# EAGLE design ICDI_Bridge (EAGLE 9.2.2)
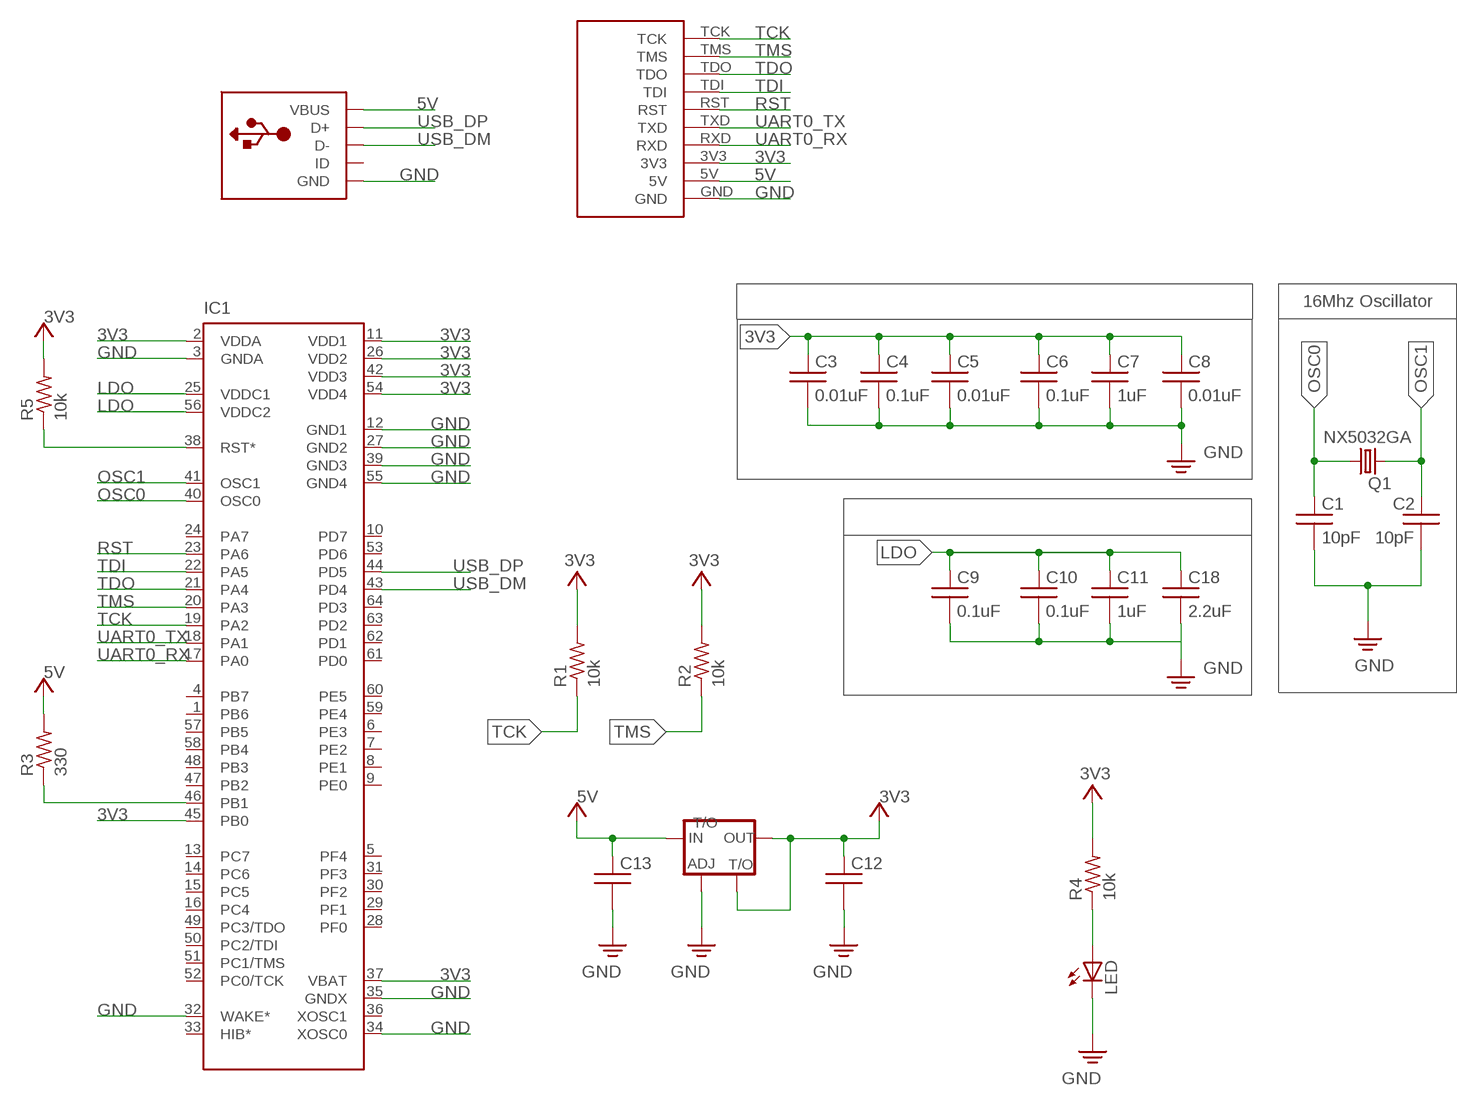
[diagram p0: schematic, sheet 1]

## Parts
C1  10pF  CAPACITORC0603K  [C0603K]
C2  10pF  CAPACITORC0603K  [C0603K]
C3  0.01uF  CAPACITORC0603K  [C0603K]
C4  0.1uF  CAPACITORC0603K  [C0603K]
C5  0.01uF  CAPACITORC0603K  [C0603K]
C6  0.1uF  CAPACITORC0603K  [C0603K]
C7  1uF  CAPACITORC0603K  [C0603K]
C8  0.01uF  CAPACITORC0603K  [C0603K]
C9  0.1uF  CAPACITORC0603K  [C0603K]
C10  0.1uF  CAPACITORC0603K  [C0603K]
C11  1uF  CAPACITORC0603K  [C0603K]
C12  CAPACITORC0805K  [C0805K]
C13  CAPACITORC0603K  [C0603K]
C18  2.2uF  CAPACITORC0603K  [C0603K]
IC1  TM4C123GH6PM  [SQFP-S-10X10-64]
LED  LEDCHIPLED_0603  [CHIPLED_0603]
Q1  NX5032GA  [NX5032GA]
R1  10k  RESISTORR0603  [R0603]
R2  10k  RESISTORR0603  [R0603]
R3  330  RESISTORR0603  [R0603]
R4  10k  RESISTORR0603  [R0603]
R5  10k  RESISTORR0603  [R0603]
U$1  USB_MICRO_PTH  [USB_MICRO_PTH]
U$2  JTAG_SERIAL  [JTAG_SERIAL_PTH]
U$4  _VOLTAGE_REGULATOR_AMS1117  [_PACKAGE_SOT223]

## Nets
3V3: C3.1 C4.1 C5.1 C6.1 C7.1 C8.1 C12.1 IC1.2(VDDA) IC1.11(VDD1) IC1.26(VDD2) IC1.37(VBAT) IC1.42(VDD3) IC1.45(PB0) IC1.54(VDD4) R1.2 R2.2 R4.2 R5.2 U$2.3V3 U$4.2(OUT) U$4.4(T/O) ; supply symbol labelled +3V3
5V: C13.1 R3.2 U$1.1(VBUS) U$2.5V U$4.3(IN) ; supply symbol labelled +5V
GND: C1.2 C2.2 C3.2 C4.2 C5.2 C6.2 C7.2 C8.2 C9.2 C10.2 C11.2 C12.2 C13.2 C18.2 IC1.3(GNDA) IC1.12(GND1) IC1.27(GND2) IC1.32(WAKE*) IC1.34(XOSC0) IC1.35(GNDX) IC1.39(GND3) IC1.55(GND4) LED.C U$1.5(GND) U$2.GND U$4.1(ADJ)
LDO: C9.1 C10.1 C11.1 C18.1 IC1.25(VDDC1) IC1.56(VDDC2)
N$1: LED.A R4.1
N$2: IC1.46(PB1) R3.1
N$4: IC1.38(RST*) R5.1
OSC0: C1.1 IC1.40(OSC0) Q1.1
OSC1: C2.1 IC1.41(OSC1) Q1.2
RST: IC1.23(PA6) U$2.RST
TCK: IC1.19(PA2) R1.1 U$2.TCK
TDI: IC1.22(PA5) U$2.TDI
TDO: IC1.21(PA4) U$2.TDO
TMS: IC1.20(PA3) R2.1 U$2.TMS
UART0_RX: IC1.17(PA0) U$2.RXD
UART0_TX: IC1.18(PA1) U$2.TXD
USB_DM: IC1.43(PD4) U$1.2(D-)
USB_DP: IC1.44(PD5) U$1.3(D+)
Unconnected: IC1.1(PB6) IC1.4(PB7) IC1.5(PF4) IC1.6(PE3) IC1.7(PE2) IC1.8(PE1) IC1.9(PE0) IC1.10(PD7) IC1.13(PC7) IC1.14(PC6) IC1.15(PC5) IC1.16(PC4) IC1.24(PA7) IC1.28(PF0) IC1.29(PF1) IC1.30(PF2) IC1.31(PF3) IC1.33(HIB*) IC1.36(XOSC1) IC1.47(PB2) IC1.48(PB3) IC1.49(PC3/TDO) IC1.50(PC2/TDI) IC1.51(PC1/TMS) IC1.52(PC0/TCK) IC1.53(PD6) IC1.57(PB5) IC1.58(PB4) IC1.59(PE4) IC1.60(PE5) IC1.61(PD0) IC1.62(PD1) IC1.63(PD2) IC1.64(PD3) U$1.4(ID)

## Notes on the sheet
- 16Mhz Oscillator

## Library data of the parts
C1-C13 C18 = UT_ECE:CAPACITOR: CAPACITOR, American symbol
IC1 = UT_ECE:TM4C123: Tiva™ TM4C123GH6PM Microcontroller Texas Instrument's Tiva™ C Series microcontrollers provide designers a high-performance ARM® Cortex™-M-based architecture with a broad set of integration capabilities and a strong ecosystem of software and development tools. Targeting performance and flexibility, the Tiva™ C Series architecture offers a 80 MHz Cortex-M with FPU, a variety of integrated memories and multiple programmable GPIO. Tiva™ C Series devices offer consumers compelling cost-effective solutions by integrating application-specific peripherals and providing a comprehensive library of software tools which minimize board costs and design-cycle time. Offering quicker time-to-market and cost savings, the Tiva™ C Series microcontrollers are the leading choice in high-performance 32-bit applications.
LED = adafruit:LED: LED OSRAM: - CHIPLED LG R971, LG N971, LY N971, LG Q971, LY Q971, LO R971, LY R971 LH N974, LH R974 LS Q976, LO Q976, LY Q976 LO Q996 - Hyper CHIPLED LW Q18S LB Q993, LB Q99A, LB R99A - SideLED LS A670, LO A670, LY A670, LG A670, LP A670 LB A673, LV A673, LT A673, LW A673 LH A674 LY A675 LS A676, LA A676, LO A676, LY A676, LW A676 LS A679, LY A679, LG A679 - Hyper Micro SIDELED® LS Y876, LA Y876, LO Y876, LY Y876 LT Y87S - SmartLED LW L88C, LW L88S LB L89C, LB L89S, LG L890 LS L89K, LO L89K, LY L89K LS L896, LA L896, LO L896, LY L896 - TOPLED LS T670, LO T670, LY T670, LG T670, LP T670 LSG T670, LSP T670, LSY T670, LOP T670, LYG T670 LG T671, LOG T671, LSG T671 LB T673, LV T673, LT T673, LW T673 LH T674 LS T676, LA T676, LO T676, LY T676, LB T676, LH T676, LSB T676, LW T676 LB T67C, LV T67C, LT T67C, LS T67K, LO T67K, LY T67K, LW E67C LS E67B, LA E67B, LO E67B, LY E67B, LB E67C, LV E67C, LT E67C LW T67C LS T679, LY T679, LG T679 LS T770, LO T770, LY T770, LG T770, LP T770 LB T773, LV T773, LT T773, LW T773 LH T774 LS E675, LA E675, LY E675, LS T675 LS T776, LA T776, LO T776, LY T776, LB T776 LHGB T686 LT T68C, LB T68C - Hyper Mini TOPLED® LB M676 - Mini TOPLED Santana® LG M470 LS M47K, LO M47K, LY M47K Source: http://www.osram.convergy.de/
Q1 = UT_ECE:NX5032GA: 16 MHz Crystal 4mm SMD Digikey NX5032GA-16.000000; OC_FARNELL: unknown; OC_NEWARK: unknown
R1-R5 = UT_ECE:RESISTOR: RESISTOR, American symbol
U$1 = Z:USB_MICRO_PTH
U$2 = Z:JTAG_SERIAL
U$4 = Z:_VOLTAGE_REGULATOR_AMS1117

## Board
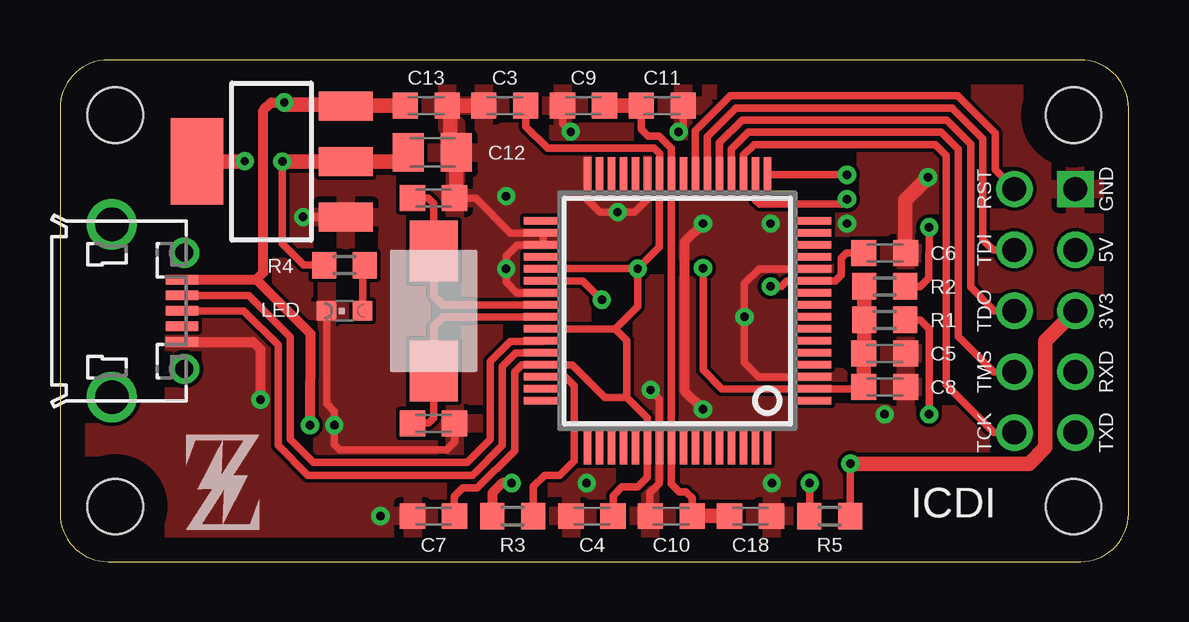
[diagram p1: board, top side]
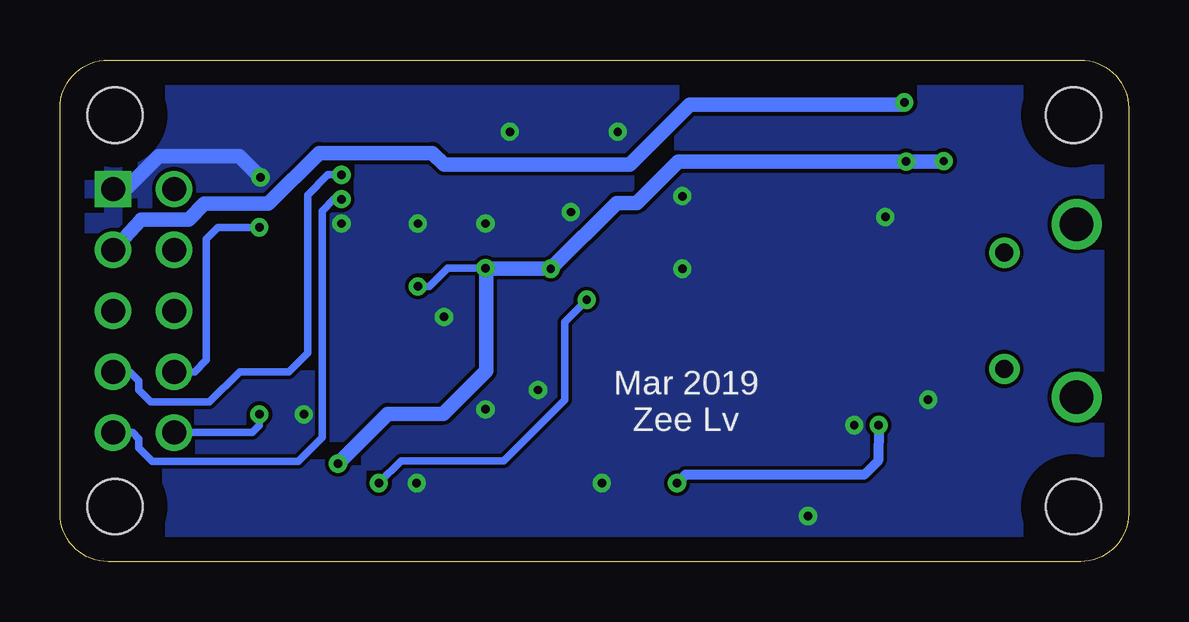
[diagram p2: board, bottom side, seen from below]

Size 44.52 x 20.92 mm. Coordinates in mm from the lower left corner, seen from the top.
Outline: 44.52,2 44.52,18.92 arc90 42.52,20.92 2,20.92 arc90 0,18.92 0,2 arc90 2,0 42.52,0 arc90 44.52,2
Copper layers (1*16): Top 0.035mm / dielectric 1.5mm / Bottom 0.035mm
Design rules "default": minimum track width 6mil, minimum drill 0.35mm, track to track 6mil, track to pad 6mil, pad to pad 6mil, via to via 6mil, smd to smd 6mil, copper to edge 40mil, drill to drill 6mil, minimum pad ring 10mil, minimum via ring 8mil, stop-mask expansion 4mil, vias tented up to drill 0mil, thermal gap 10mil
Holes 2.3 mm at 2.3,2.3 42.22,2.3 2.3,18.62 42.22,18.62

### Footprints (pad centres in the part's own frame; a part is rotated, then mirrored left to right if it is on the bottom)
C0603K = smd 1.05 x 1.08: 1 -0.875,0; 2 0.875,0
C0805K = smd 1.3 x 1.6: 1 -1,0; 2 1,0
SQFP-S-10X10-64 = smd 0.3 x 1.6: 1 -3.75,-5.6; 2 -3.25,-5.6; 3 -2.75,-5.6; 4 -2.25,-5.6; 5 -1.75,-5.6; 6 -1.25,-5.6; 7 -0.75,-5.6; 8 -0.25,-5.6; 9 0.25,-5.6; 10 0.75,-5.6; 11 1.25,-5.6; 12 1.75,-5.6; 13 2.25,-5.6; 14 2.75,-5.6; 15 3.25,-5.6; 16 3.75,-5.6; 33 3.75,5.6; 34 3.25,5.6; 35 2.75,5.6; 36 2.25,5.6; 37 1.75,5.6; 38 1.25,5.6; 39 0.75,5.6; 40 0.25,5.6; 41 -0.25,5.6; 42 -0.75,5.6; 43 -1.25,5.6; 44 -1.75,5.6; 45 -2.25,5.6; 46 -2.75,5.6; 47 -3.25,5.6; 48 -3.75,5.6 | smd 1.6 x 0.3: 17 5.6,-3.75; 18 5.6,-3.25; 19 5.6,-2.75; 20 5.6,-2.25; 21 5.6,-1.75; 22 5.6,-1.25; 23 5.6,-0.75; 24 5.6,-0.25; 25 5.6,0.25; 26 5.6,0.75; 27 5.6,1.25; 28 5.6,1.75; 29 5.6,2.25; 30 5.6,2.75; 31 5.6,3.25; 32 5.6,3.75; 49 -5.6,3.75; 50 -5.6,3.25; 51 -5.6,2.75; 52 -5.6,2.25; 53 -5.6,1.75; 54 -5.6,1.25; 55 -5.6,0.75; 56 -5.6,0.25; 57 -5.6,-0.25; 58 -5.6,-0.75; 59 -5.6,-1.25; 60 -5.6,-1.75; 61 -5.6,-2.25; 62 -5.6,-2.75; 63 -5.6,-3.25; 64 -5.6,-3.75
CHIPLED_0603 = smd 0.8 x 0.8: A 0,-0.75; C 0,0.75
NX5032GA = smd 2.54 x 2: 1 -2.5,0; 2 2.5,0
R0603 = smd 1 x 1.1: 1 -0.85,0; 2 0.85,0
USB_MICRO_PTH = smd 1.35 x 0.4: 1 4.825,1.3; 2 4.825,0.65; 3 4.825,0; 4 4.825,-0.65; 5 4.825,-1.3 | drill 1.397: S1 1.905,-3.6; S2 1.905,3.6 | drill 0.762: S3 4.923,2.425; S4 4.923,-2.425
JTAG_SERIAL_PTH = drill 1: 3V3 0,-1.27; 5V 2.54,-1.27; RST 5.08,1.27; RXD -2.54,-1.27; TCK -5.08,1.27; TDI 2.54,1.27; TDO 0,1.27; TMS -2.54,1.27; TXD -5.08,-1.27 | drill 1 square: GND 5.08,-1.27
_PACKAGE_SOT223 = smd 1.219 x 2.235: 1 -2.311,-3.099; 2 0,-3.099; 3 2.311,-3.099 | smd 3.6 x 2.2: 4 0,3.099

### Placement (x,y rotation side)
C1  15.57,15.16 0 top
C2  15.57,5.76 0 top
C3  18.54,19.02 180 top
C4  22.17,1.9 180 top
C5  34.36,8.68 0 top
C6  34.36,12.87 0 top
C7  15.57,1.9 180 top
C8  34.36,7.29 0 top
C9  21.81,19.02 180 top
C10  25.47,1.9 180 top
C11  25.09,19.02 0 top
C12  15.51,17.06 0 top
C13  15.26,19.02 0 top
C18  28.77,1.9 0 top
IC1  25.73,10.46 90 top
LED  11.86,10.46 90 top
Q1  15.57,10.46 270 top
R1  34.36,10.08 180 top
R2  34.36,11.48 180 top
R3  18.87,1.9 180 top
R4  11.86,12.37 180 top
R5  32.08,1.9 0 top
U$1  0.25,10.46 0 top
U$2  41.04,10.46 90 top
U$3  [__LOGO_Z]  5.25,1.32 0 top
U$4  8.81,16.68 90 top

### Tracks (layer width: path | path; a pad name or v marks a point on that pad's centre or on a via)
3V3  (via drill 0.35)
  Top 0.305: C8.1 33.41,7.21 IC1.2 27.58,7.21 26.79,8 v26.79,12.24 | v24.07,12.21 24.98,13.11 IC1.26 24.98,17.01 24.75,17.24 20.32,17.24 19.41,18.14 C3.1 | v24.07,12.21 IC1.37 | v24.07,12.21 24.07,10.64 23.14,9.7 | 23.14,9.7 20.14,9.7 IC1.42 | v29.61,11.48 30.04,11.48 30.28,11.71 IC1.11 32.31,11.71 32.56,11.96 32.56,12.67 32.76,12.87 C6.1 | 23.14,9.7 23.62,9.21 23.62,6.85 | 23.62,6.85 24.48,6 IC1.54 24.48,3.52 24.07,3.12 23.41,3.12 23.04,2.75 C4.1 | 23.62,6.85 22.7,6.85 21.35,8.21 IC1.45 19.23,8.21 18.94,7.92 18.94,4.62 17.39,3.07 16.79,3.07 16.43,2.71 16.43,1.91 C7.1 | R5.2 32.92,4.07 v32.94,4.08 | R4.2 10.15,12.37 9.27,13.25 v9.27,16.68
  Top 0.61: C8.1 C5.1 33.51,8.71 R1.2 R2.2 | U$2.3V3 41.05,9.2 41.05,4.75 40.38,4.08 v32.94,4.08 | v9.27,16.68 U$4.2 14.18,16.68 C12.1 | v7.7,16.7 7.68,16.68 U$4.4
  Bottom 0.305: v26.79,12.24 28.37,12.24 29.13,11.48 v29.61,11.48
  Bottom 0.61: 26.77,12.21 v24.07,12.21 21.33,14.96 20.49,14.96 18.77,16.68 v9.27,16.68 7.72,16.68 v7.7,16.7 | 26.77,12.21 v26.79,12.24 | v32.94,4.08 30.86,6.17 28.55,6.17 26.77,7.95 26.77,12.21
5V  (via drill 0.35)
  Top 0.406: U$1.1 8.18,11.76 | 8.18,11.76 8.48,12.06 8.48,18.82 8.81,19.15 v9.34,19.15 | 8.18,11.76 10.44,9.5 v10.41,5.69 | v18.82,3.28 18.44,3.28 18.02,2.86 R3.2
  Top 0.61: v9.34,19.15 9.44,19.05 11.88,19.05 U$4.3 11.96,19.02 C13.1
  Bottom 0.406: v10.41,5.69 10.44,4.21 11.02,3.63 18.47,3.63 v18.82,3.28
  Bottom 0.61: U$2.5V 41.14,14.27 39.16,14.27 38.5,14.93 35.84,14.93 33.73,17.04 29,17.04 28.52,16.56 20.77,16.56 18.28,19.05 9.44,19.05 v9.34,19.15
GND  (via drill 0.35)
  Top 0.305: IC1.27 24.48,15.1 23.95,14.57 v23.24,14.57 22.5,14.57 21.98,15.1 IC1.32 | v24.61,7.16 24.98,6.79 IC1.55 24.98,3.26 24.58,2.87 24.58,1.91 C10.2 | IC1.3 29.11,7.71 28.52,8.3 v28.52,10.21 28.52,11.6 29.13,12.21 IC1.12 | IC1.39 19.03,11.21 18.59,11.65 v18.59,12.21 18.59,12.75 19.05,13.21 IC1.35 IC1.34 18.77,13.71 17.32,15.16 C1.2 | C2.2 16.44,4.99 16.12,4.67 11.65,4.67 11.43,4.89 v11.43,5.69 11.43,6.27 11.11,6.6 LED.C | C9.2 20.94,18.27 v21.28,17.93 | C11.2 25.96,18.12 v25.78,17.93
  Top 0.381: U$4.1 v10.13,14.37
  Top 0.406: U$1.5 8.05,9.16 8.35,8.86 v8.35,6.75 | v26.79,6.35 26.04,7.11 26.04,13.34 v26.79,14.1
  Top 0.61: C6.2 35.23,12.88 35.23,15.08 v36.16,16.02 | C3.2 C13.2 16.26,18.89 16.26,17.32 C12.2 16.52,15.23 C1.2
  Bottom 0.61: U$2.GND 41.77,15.54 40.4,16.91 37.05,16.91 v36.16,16.02
  other vias: 29.66,3.28 34.36,6.14 32.79,14.1 18.59,15.24 21.95,3.28 29.61,14.1 13.36,1.9
  pour Top: 44.54,2.13 44.54,18.92 arc90 42.54,20.92 2,20.92 arc90 0,18.92 0,2.13 arc90 2,0.13 42.54,0.13 arc90
  pour Bottom: 44.54,2.13 44.54,18.92 arc90 42.54,20.92 2,20.92 arc90 0,18.92 0,2.13 arc90 2,0.13 42.54,0.13 arc90
LDO
  Top 0.305: C10.1 26.35,2.65 26.08,2.92 25.8,2.92 25.48,3.24 IC1.56 IC1.25 25.48,17.24 24.96,17.75 24.51,17.75 24.21,18.04 C11.1
  Top 0.61: C10.1 C18.1 | C9.1 C11.1
N$1
  Top 0.305: R4.1 12.61,12.27 LED.A
N$2
  Top 0.305: IC1.46 21.06,7.71 21.43,7.34 21.43,4.21 20.82,3.6 20.19,3.6 19.72,3.13 R3.1
N$4  (via drill 0.35)
  Top 0.305: IC1.38 21.78,11.71 v22.58,10.92 | v31.24,3.28 31.24,1.91 R5.1
  Bottom 0.305: v22.58,10.92 23.49,10 23.49,6.75 26.03,4.21 30.3,4.21 v31.24,3.28
OSC0
  Top 0.305: IC1.40 15.95,10.71 15.56,11.1 Q1.1 15.56,14.93 15.34,15.16 C1.1
OSC1
  Top 0.305: IC1.41 15.95,10.21 15.56,9.82 Q1.2 15.56,5.99 15.36,5.79 14.72,5.79 C2.1
RST
  Top 0.305: IC1.23 26.48,17.97 27.93,19.43 37.41,19.43 38.96,17.88 38.96,16.35 U$2.RST
TCK  (via drill 0.35)
  Top 0.305: IC1.19 28.48,16.94 28.93,17.39 36.47,17.39 36.93,16.94 36.93,7.36 38.91,5.38 U$2.TCK | R1.1 35.84,10.08 36.22,9.7 v36.22,6.14
  Bottom 0.305: U$2.TCK 36.52,5.38 36.22,5.68 v36.22,6.14
TDI
  Top 0.305: IC1.22 26.98,17.73 28.16,18.92 37.18,18.92 38.45,17.65 38.45,13.43 38.88,13 U$2.TDI
TDO
  Top 0.305: IC1.21 27.48,17.47 28.42,18.41 36.95,18.41 37.94,17.42 37.94,11.45 38.93,10.46 U$2.TDO
TMS  (via drill 0.35)
  Top 0.305: IC1.20 27.98,17.21 28.67,17.9 36.72,17.9 37.44,17.19 37.44,9.39 38.91,7.92 U$2.TMS | R2.1 35.84,11.48 36.19,11.83 v36.22,13.94
  Bottom 0.305: v36.22,13.94 37.94,13.94 38.42,13.46 38.42,8.4 38.91,7.92 U$2.TMS
UART0_RX  (via drill 0.35)
  Top 0.305: IC1.17 29.54,16.13 v32.79,16.13
  Bottom 0.305: U$2.RXD 41.62,7.92 41.24,7.54 41.24,7.16 40.73,6.65 38.3,6.65 37.03,7.92 35,7.92 34.21,8.71 34.21,15.29 33.37,16.13 v32.79,16.13
UART0_TX  (via drill 0.35)
  Top 0.305: IC1.18 28.98,15.08 29.15,14.9 32.58,14.9 v32.79,15.11
  Bottom 0.305: U$2.TXD 41.49,5.38 41.24,5.13 41.24,4.74 40.68,4.19 34.59,4.19 33.6,5.18 33.6,14.63 33.11,15.11 v32.79,15.11
USB_DM
  Top 0.305: IC1.43 20.11,9.19 18.77,9.19 17.93,8.35 17.93,5.1 16.96,4.13 10.56,4.13 9.6,5.1 9.6,9.37 7.87,11.1 5.09,11.1 U$1.2
USB_DP
  Top 0.305: IC1.44 19,8.71 18.44,8.15 18.44,4.85 17.19,3.6 10.33,3.6 9.09,4.85 9.09,9.04 7.67,10.46 U$1.3

### Text on the board
tNames: ICDI
bNames: Mar 2019 / Zee Lv